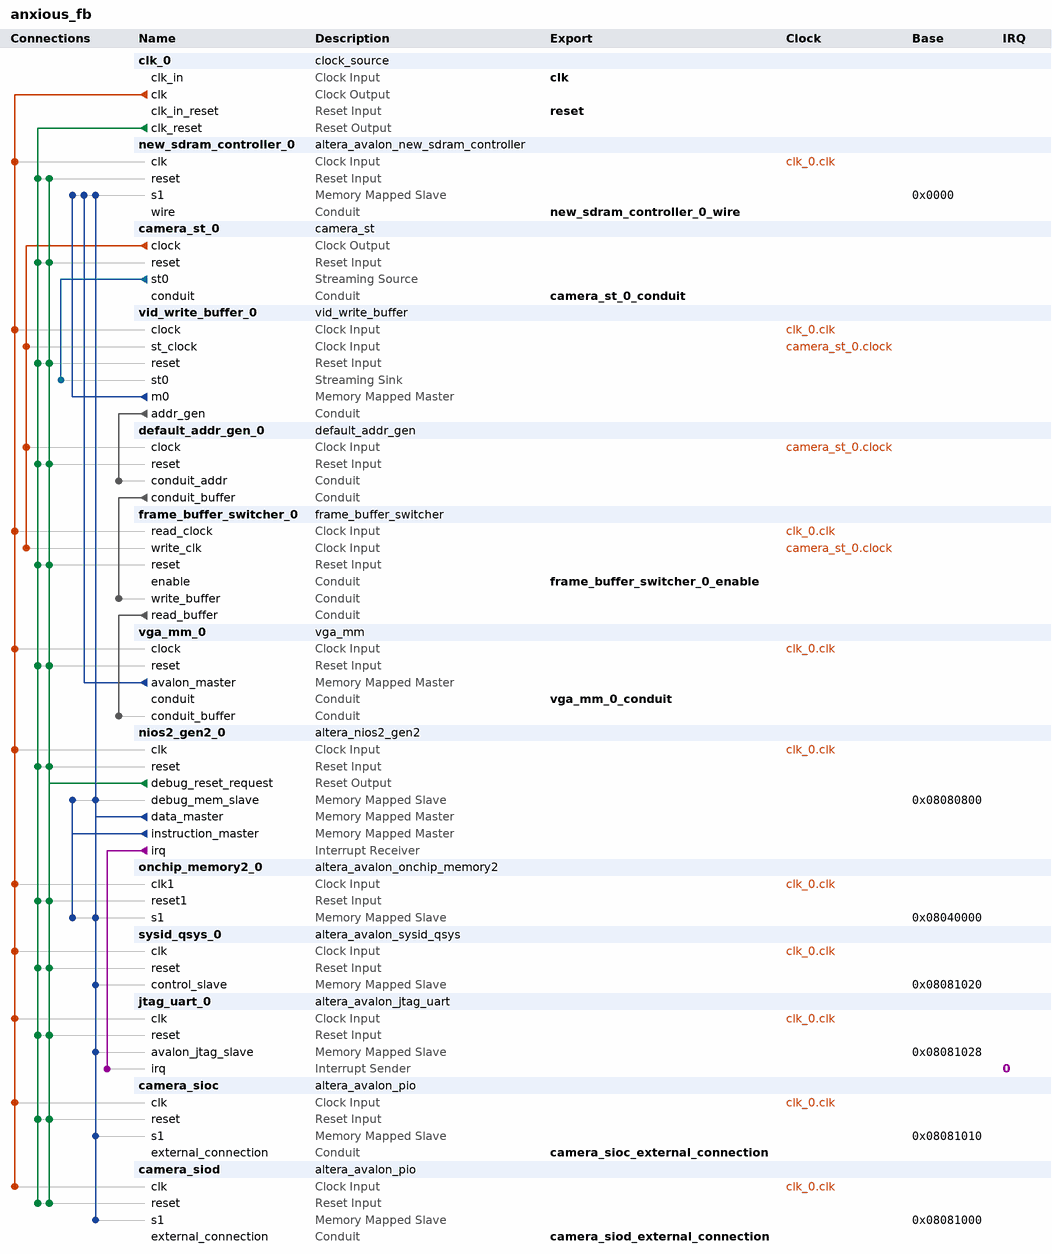
[diagram p0: system contents]
# Platform Designer (Qsys) system anxious_fb, Cyclone IV GX EP4CGX150DF31C7
# Parameters at their usual value, and those the tool derives, are not listed.
package require -exact qsys 15.0
create_system anxious_fb
set_project_property DEVICE_FAMILY {Cyclone IV GX}
set_project_property DEVICE EP4CGX150DF31C7

add_instance clk_0 clock_source 15.0
set_instance_parameter_value clk_0 clockFrequency 100000000

add_instance new_sdram_controller_0 altera_avalon_new_sdram_controller 15.0
set_instance_parameter_value new_sdram_controller_0 TAC 5.5
set_instance_parameter_value new_sdram_controller_0 TRCD 20.0
set_instance_parameter_value new_sdram_controller_0 TRP 20.0
set_instance_parameter_value new_sdram_controller_0 casLatency 3
set_instance_parameter_value new_sdram_controller_0 columnWidth 10
set_instance_parameter_value new_sdram_controller_0 dataWidth 32
set_instance_parameter_value new_sdram_controller_0 generateSimulationModel false
set_instance_parameter_value new_sdram_controller_0 initRefreshCommands 8
set_instance_parameter_value new_sdram_controller_0 model single_Micron_MT48LC4M32B2_7_chip
set_instance_parameter_value new_sdram_controller_0 numberOfBanks 4
set_instance_parameter_value new_sdram_controller_0 numberOfChipSelects 1
set_instance_parameter_value new_sdram_controller_0 powerUpDelay 100.0
set_instance_parameter_value new_sdram_controller_0 refreshPeriod 8.1725
set_instance_parameter_value new_sdram_controller_0 rowWidth 13

add_instance camera_st_0 camera_st 1.0
set_instance_parameter_value camera_st_0 DATA_WIDTH 32

add_instance vid_write_buffer_0 vid_write_buffer 2.0
set_instance_parameter_value vid_write_buffer_0 ADDR_WIDTH 27
set_instance_parameter_value vid_write_buffer_0 DATA_WIDTH 32
set_instance_parameter_value vid_write_buffer_0 FIFO_LENGTH_LOG_2 6

add_instance default_addr_gen_0 default_addr_gen 1.0
set_instance_parameter_value default_addr_gen_0 ADDR_WIDTH 27
set_instance_parameter_value default_addr_gen_0 BANK 0
set_instance_parameter_value default_addr_gen_0 HEIGHT 480
set_instance_parameter_value default_addr_gen_0 WIDTH 640

add_instance frame_buffer_switcher_0 frame_buffer_switcher 2.0

add_instance vga_mm_0 vga_mm 1.0
set_instance_parameter_value vga_mm_0 ADDR_WIDTH 27
set_instance_parameter_value vga_mm_0 BANK 0
set_instance_parameter_value vga_mm_0 DATA_WIDTH 32
set_instance_parameter_value vga_mm_0 FIFO_LENGTH_LOG_2 6
set_instance_parameter_value vga_mm_0 FRAME_PIXELS 307200

add_instance nios2_gen2_0 altera_nios2_gen2 15.0
set_instance_parameter_value nios2_gen2_0 dcache_size 2048
set_instance_parameter_value nios2_gen2_0 exceptionSlave onchip_memory2_0.s1
set_instance_parameter_value nios2_gen2_0 icache_size 4096
set_instance_parameter_value nios2_gen2_0 impl Fast
set_instance_parameter_value nios2_gen2_0 resetSlave onchip_memory2_0.s1

add_instance onchip_memory2_0 altera_avalon_onchip_memory2 15.0
set_instance_parameter_value onchip_memory2_0 dataWidth 32
set_instance_parameter_value onchip_memory2_0 dualPort false
set_instance_parameter_value onchip_memory2_0 initMemContent true
set_instance_parameter_value onchip_memory2_0 initializationFileName onchip_mem.hex
set_instance_parameter_value onchip_memory2_0 memorySize 204800

add_instance sysid_qsys_0 altera_avalon_sysid_qsys 15.0
set_instance_parameter_value sysid_qsys_0 id 0

add_instance jtag_uart_0 altera_avalon_jtag_uart 15.0
set_instance_parameter_value jtag_uart_0 simInteractiveOptions NO_INTERACTIVE_WINDOWS

add_instance camera_sioc altera_avalon_pio 15.0
set_instance_parameter_value camera_sioc direction Output
set_instance_parameter_value camera_sioc width 1

add_instance camera_siod altera_avalon_pio 15.0
set_instance_parameter_value camera_siod direction Bidir
set_instance_parameter_value camera_siod width 1

# connections
add_connection camera_st_0.clock default_addr_gen_0.clock clock
add_connection camera_st_0.clock frame_buffer_switcher_0.write_clk clock
add_connection camera_st_0.clock vid_write_buffer_0.st_clock clock
add_connection clk_0.clk camera_sioc.clk clock
add_connection clk_0.clk camera_siod.clk clock
add_connection clk_0.clk frame_buffer_switcher_0.read_clock clock
add_connection clk_0.clk jtag_uart_0.clk clock
add_connection clk_0.clk new_sdram_controller_0.clk clock
add_connection clk_0.clk nios2_gen2_0.clk clock
add_connection clk_0.clk onchip_memory2_0.clk1 clock
add_connection clk_0.clk sysid_qsys_0.clk clock
add_connection clk_0.clk vga_mm_0.clock clock
add_connection clk_0.clk vid_write_buffer_0.clock clock
add_connection clk_0.clk_reset camera_sioc.reset reset
add_connection clk_0.clk_reset camera_siod.reset reset
add_connection clk_0.clk_reset camera_st_0.reset reset
add_connection clk_0.clk_reset default_addr_gen_0.reset reset
add_connection clk_0.clk_reset frame_buffer_switcher_0.reset reset
add_connection clk_0.clk_reset jtag_uart_0.reset reset
add_connection clk_0.clk_reset new_sdram_controller_0.reset reset
add_connection clk_0.clk_reset nios2_gen2_0.reset reset
add_connection clk_0.clk_reset onchip_memory2_0.reset1 reset
add_connection clk_0.clk_reset sysid_qsys_0.reset reset
add_connection clk_0.clk_reset vga_mm_0.reset reset
add_connection clk_0.clk_reset vid_write_buffer_0.reset reset
add_connection nios2_gen2_0.debug_reset_request camera_sioc.reset reset
add_connection nios2_gen2_0.debug_reset_request camera_siod.reset reset
add_connection nios2_gen2_0.debug_reset_request camera_st_0.reset reset
add_connection nios2_gen2_0.debug_reset_request default_addr_gen_0.reset reset
add_connection nios2_gen2_0.debug_reset_request frame_buffer_switcher_0.reset reset
add_connection nios2_gen2_0.debug_reset_request jtag_uart_0.reset reset
add_connection nios2_gen2_0.debug_reset_request new_sdram_controller_0.reset reset
add_connection nios2_gen2_0.debug_reset_request nios2_gen2_0.reset reset
add_connection nios2_gen2_0.debug_reset_request onchip_memory2_0.reset1 reset
add_connection nios2_gen2_0.debug_reset_request sysid_qsys_0.reset reset
add_connection nios2_gen2_0.debug_reset_request vga_mm_0.reset reset
add_connection nios2_gen2_0.debug_reset_request vid_write_buffer_0.reset reset
add_connection nios2_gen2_0.data_master camera_sioc.s1 avalon
set_connection_parameter_value nios2_gen2_0.data_master/camera_sioc.s1 baseAddress 0x08081010
add_connection nios2_gen2_0.data_master camera_siod.s1 avalon
set_connection_parameter_value nios2_gen2_0.data_master/camera_siod.s1 baseAddress 0x08081000
add_connection nios2_gen2_0.data_master jtag_uart_0.avalon_jtag_slave avalon
set_connection_parameter_value nios2_gen2_0.data_master/jtag_uart_0.avalon_jtag_slave baseAddress 0x08081028
add_connection nios2_gen2_0.data_master new_sdram_controller_0.s1 avalon
set_connection_parameter_value nios2_gen2_0.data_master/new_sdram_controller_0.s1 baseAddress 0x0000
add_connection nios2_gen2_0.data_master nios2_gen2_0.debug_mem_slave avalon
set_connection_parameter_value nios2_gen2_0.data_master/nios2_gen2_0.debug_mem_slave baseAddress 0x08080800
add_connection nios2_gen2_0.data_master onchip_memory2_0.s1 avalon
set_connection_parameter_value nios2_gen2_0.data_master/onchip_memory2_0.s1 baseAddress 0x08040000
add_connection nios2_gen2_0.data_master sysid_qsys_0.control_slave avalon
set_connection_parameter_value nios2_gen2_0.data_master/sysid_qsys_0.control_slave baseAddress 0x08081020
add_connection nios2_gen2_0.instruction_master nios2_gen2_0.debug_mem_slave avalon
set_connection_parameter_value nios2_gen2_0.instruction_master/nios2_gen2_0.debug_mem_slave baseAddress 0x08080800
add_connection nios2_gen2_0.instruction_master onchip_memory2_0.s1 avalon
set_connection_parameter_value nios2_gen2_0.instruction_master/onchip_memory2_0.s1 baseAddress 0x08040000
add_connection vga_mm_0.avalon_master new_sdram_controller_0.s1 avalon
set_connection_parameter_value vga_mm_0.avalon_master/new_sdram_controller_0.s1 baseAddress 0x0000
add_connection vid_write_buffer_0.m0 new_sdram_controller_0.s1 avalon
set_connection_parameter_value vid_write_buffer_0.m0/new_sdram_controller_0.s1 baseAddress 0x0000
add_connection camera_st_0.st0 vid_write_buffer_0.st0 avalon_streaming
add_connection default_addr_gen_0.conduit_buffer frame_buffer_switcher_0.write_buffer conduit
add_connection frame_buffer_switcher_0.read_buffer vga_mm_0.conduit_buffer conduit
add_connection vid_write_buffer_0.addr_gen default_addr_gen_0.conduit_addr conduit
add_connection nios2_gen2_0.irq jtag_uart_0.irq interrupt
set_connection_parameter_value nios2_gen2_0.irq/jtag_uart_0.irq irqNumber 0

# exported interfaces
add_interface camera_sioc_external_connection conduit end
set_interface_property camera_sioc_external_connection EXPORT_OF camera_sioc.external_connection
add_interface camera_siod_external_connection conduit end
set_interface_property camera_siod_external_connection EXPORT_OF camera_siod.external_connection
add_interface camera_st_0_conduit conduit end
set_interface_property camera_st_0_conduit EXPORT_OF camera_st_0.conduit
add_interface clk clock sink
set_interface_property clk EXPORT_OF clk_0.clk_in
add_interface frame_buffer_switcher_0_enable conduit end
set_interface_property frame_buffer_switcher_0_enable EXPORT_OF frame_buffer_switcher_0.enable
add_interface new_sdram_controller_0_wire conduit end
set_interface_property new_sdram_controller_0_wire EXPORT_OF new_sdram_controller_0.wire
add_interface reset reset sink
set_interface_property reset EXPORT_OF clk_0.clk_in_reset
add_interface vga_mm_0_conduit conduit end
set_interface_property vga_mm_0_conduit EXPORT_OF vga_mm_0.conduit

set_interconnect_requirement {$system} qsys_mm.clockCrossingAdapter HANDSHAKE
set_interconnect_requirement {$system} qsys_mm.enableEccProtection FALSE
set_interconnect_requirement {$system} qsys_mm.insertDefaultSlave FALSE
set_interconnect_requirement {$system} qsys_mm.maxAdditionalLatency 1

save_system anxious_fb.qsys
